# EAGLE design DNVT_box3r (EAGLE 9.6.2)

## Sheet 1 of 3
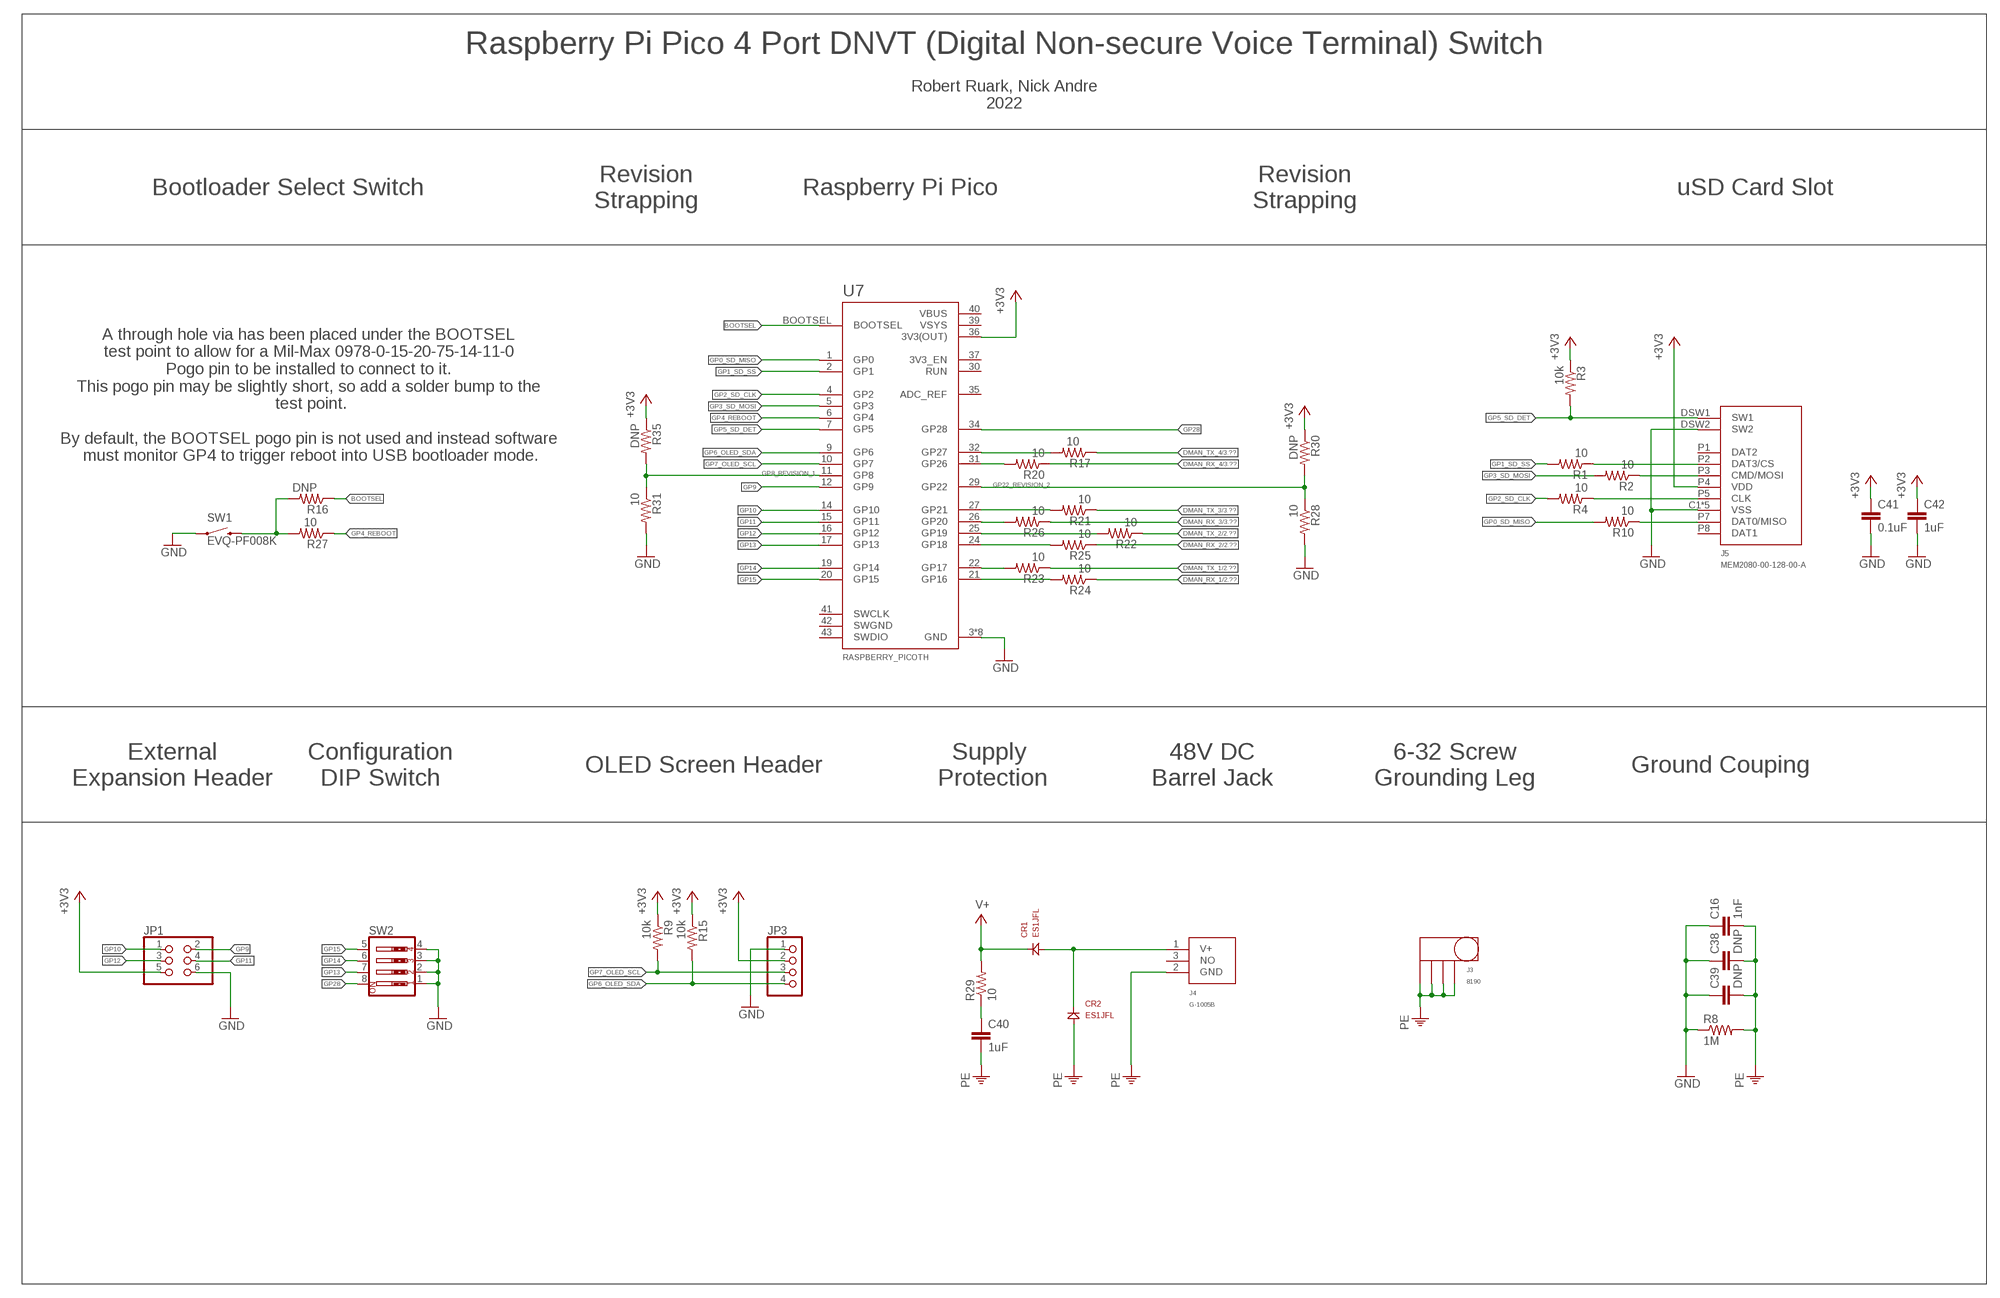
[diagram p0: schematic, sheet 1]

### Parts
C16  1nF  1206_CAPACITOR  [1206]
C38  DNP  1206_CAPACITOR  [1206]
C39  DNP  1206_CAPACITOR  [1206]
C40  1uF  1206_CAPACITOR  [1206]
C41  0.1uF  0603_CAPACITOR  [0603]
C42  1uF  0805_CAPACITOR  [0805]
CR1  ES1JFL  [SOD123(AK)]
CR2  ES1JFL  [SOD123(AK)]
J3  8190  [7781]
J4  G-1005B  [G-1005B]
J5  MEM2080-00-128-00-A  [MEM2080]
JP1  PINHD-2X3/90  [2X03/90]
JP3  PINHD-1X4  [1X04]
R1  10  0603_RESISTOR  [0603]
R2  10  0603_RESISTOR  [0603]
R3  10k  0603_RESISTOR  [0603]
R4  10  0603_RESISTOR  [0603]
R8  1M  1206_RESISTOR  [1206]
R9  10k  0603_RESISTOR  [0603]
R10  10  0603_RESISTOR  [0603]
R15  10k  0603_RESISTOR  [0603]
R16  DNP  0603_RESISTOR  [0603]
R17  10  0603_RESISTOR  [0603]
R20  10  0603_RESISTOR  [0603]
R21  10  0603_RESISTOR  [0603]
R22  10  0603_RESISTOR  [0603]
R23  10  0603_RESISTOR  [0603]
R24  10  0603_RESISTOR  [0603]
R25  10  0603_RESISTOR  [0603]
R26  10  0603_RESISTOR  [0603]
R27  10  0603_RESISTOR  [0603]
R28  10  0603_RESISTOR  [0603]
R29  10  1206_RESISTOR  [1206]
R30  DNP  0603_RESISTOR  [0603]
R31  10  0603_RESISTOR  [0603]
R35  DNP  0603_RESISTOR  [0603]
SW1  EVQ-PF008K  [EVQ-PF008K]
SW2  SW_DIP-4  [EDG-04]
U7  RASPBERRY_PICOTH  [PICO-PKG-TH]

### Nets
+3V3: C41.1 C42.1 J5.P4(VDD) JP1.5 JP3.2 R3.1 R9.1 R15.1 R30.1 R35.1 U7.36(3V3(OUT)) ; also sheet 2,3
BOOTSEL: R16.1 U7.BOOTSEL
DMAN_RX_1: R24.1 ; also sheet 2
DMAN_RX_2: R25.1 ; also sheet 2
DMAN_RX_3: R26.1 ; also sheet 3
DMAN_RX_4: R20.1 ; also sheet 3
DMAN_TX_1: R23.1 ; also sheet 2
DMAN_TX_2: R22.1 ; also sheet 2
DMAN_TX_3: R21.1 ; also sheet 3
DMAN_TX_4: R17.1 ; also sheet 3
GND: C16.1 C38.1 C39.1 C41.2 C42.2 J5.C1(VSS) J5.C2(VSS) J5.C3(VSS) J5.C4(VSS) J5.DSW2(SW2) J5.P6(VSS) JP1.6 JP3.1 R8.1 R28.2 R31.2 SW1.S1 SW2.1 SW2.2 SW2.3 SW2.4 U7.3(GND) U7.8(GND) U7.13(GND) U7.18(GND) U7.23(GND) U7.28(GND) U7.33(GND) U7.38(GND) ; also sheet 2,3
GP0_SD_MISO: R10.2 U7.1(GP0)
GP1_SD_SS: R1.2 U7.2(GP1)
GP2_SD_CLK: R4.2 U7.4(GP2)
GP3_SD_MOSI: R2.2 U7.5(GP3)
GP4_REBOOT: R27.1 U7.6(GP4)
GP5_SD_DET: J5.DSW1(SW1) R3.2 U7.7(GP5)
GP6_OLED_SDA: JP3.4 R15.2 U7.9(GP6)
GP7_OLED_SCL: JP3.3 R9.2 U7.10(GP7)
GP8_REVISION_1: R31.1 R35.2 U7.11(GP8)
GP9: JP1.2 U7.12(GP9)
GP10: JP1.1 U7.14(GP10)
GP11: JP1.4 U7.15(GP11)
GP12: JP1.3 U7.16(GP12)
GP13: SW2.7 U7.17(GP13)
GP14: SW2.6 U7.19(GP14)
GP15: SW2.5 U7.20(GP15)
GP22_REVISION_2: R28.1 R30.2 U7.29(GP22)
GP28: SW2.8 U7.34(GP28)
N$7: R20.2 U7.31(GP26)
N$13: R17.2 U7.32(GP27)
N$17: R24.2 U7.21(GP16)
N$18: R23.2 U7.22(GP17)
N$19: R16.2 R27.2 SW1.S2
N$20: CR1.A CR2.K J4.1(V+)
N$21: R25.2 U7.24(GP18)
N$22: R22.2 U7.25(GP19)
N$23: R21.2 U7.27(GP21)
N$24: R26.2 U7.26(GP20)
N$25: J5.P5(CLK) R4.1
N$27: C40.1 R29.1
N$28: J5.P7(DAT0/MISO) R10.1
N$30: J5.P3(CMD/MOSI) R2.1
N$31: J5.P2(DAT3/CS) R1.1
PE: C16.2 C38.2 C39.2 C40.2 CR2.A J3.P$1 J3.P$2 J3.P$3 J3.P$4 J4.2(GND) R8.2 ; also sheet 2,3
V+: CR1.K R29.2 ; also sheet 2,3
Unconnected: J4.3(NO) J5.P1(DAT2) J5.P8(DAT1) U7.30(RUN) U7.35(ADC_REF) U7.37(3V3_EN) U7.41(SWCLK) U7.43(SWDIO)

### Notes on the sheet
- Raspberry Pi Pico 4 Port DNVT (Digital Non-secure Voice Terminal) Switch
- Robert Ruark, Nick Andre
  2022
- Bootloader Select Switch
- Revision
  Strapping
- Raspberry Pi Pico
- Revision
  Strapping
- uSD Card Slot
- A through hole via has been placed under the BOOTSEL 
  test point to allow for a Mil-Max 0978-0-15-20-75-14-11-0 
  Pogo pin to be installed to connect to it. 
  This pogo pin may be slightly short, so add a solder bump to the 
  test point.
  
  By default, the BOOTSEL pogo pin is not used and instead software 
  must monitor GP4 to trigger reboot into USB bootloader mode.
- External
  Expansion Header
- Configuration
  DIP Switch
- OLED Screen Header
- Supply 
  Protection
- 48V DC
  Barrel Jack
- 6-32 Screw
  Grounding Leg
- Ground Couping

## Sheet 2 of 3
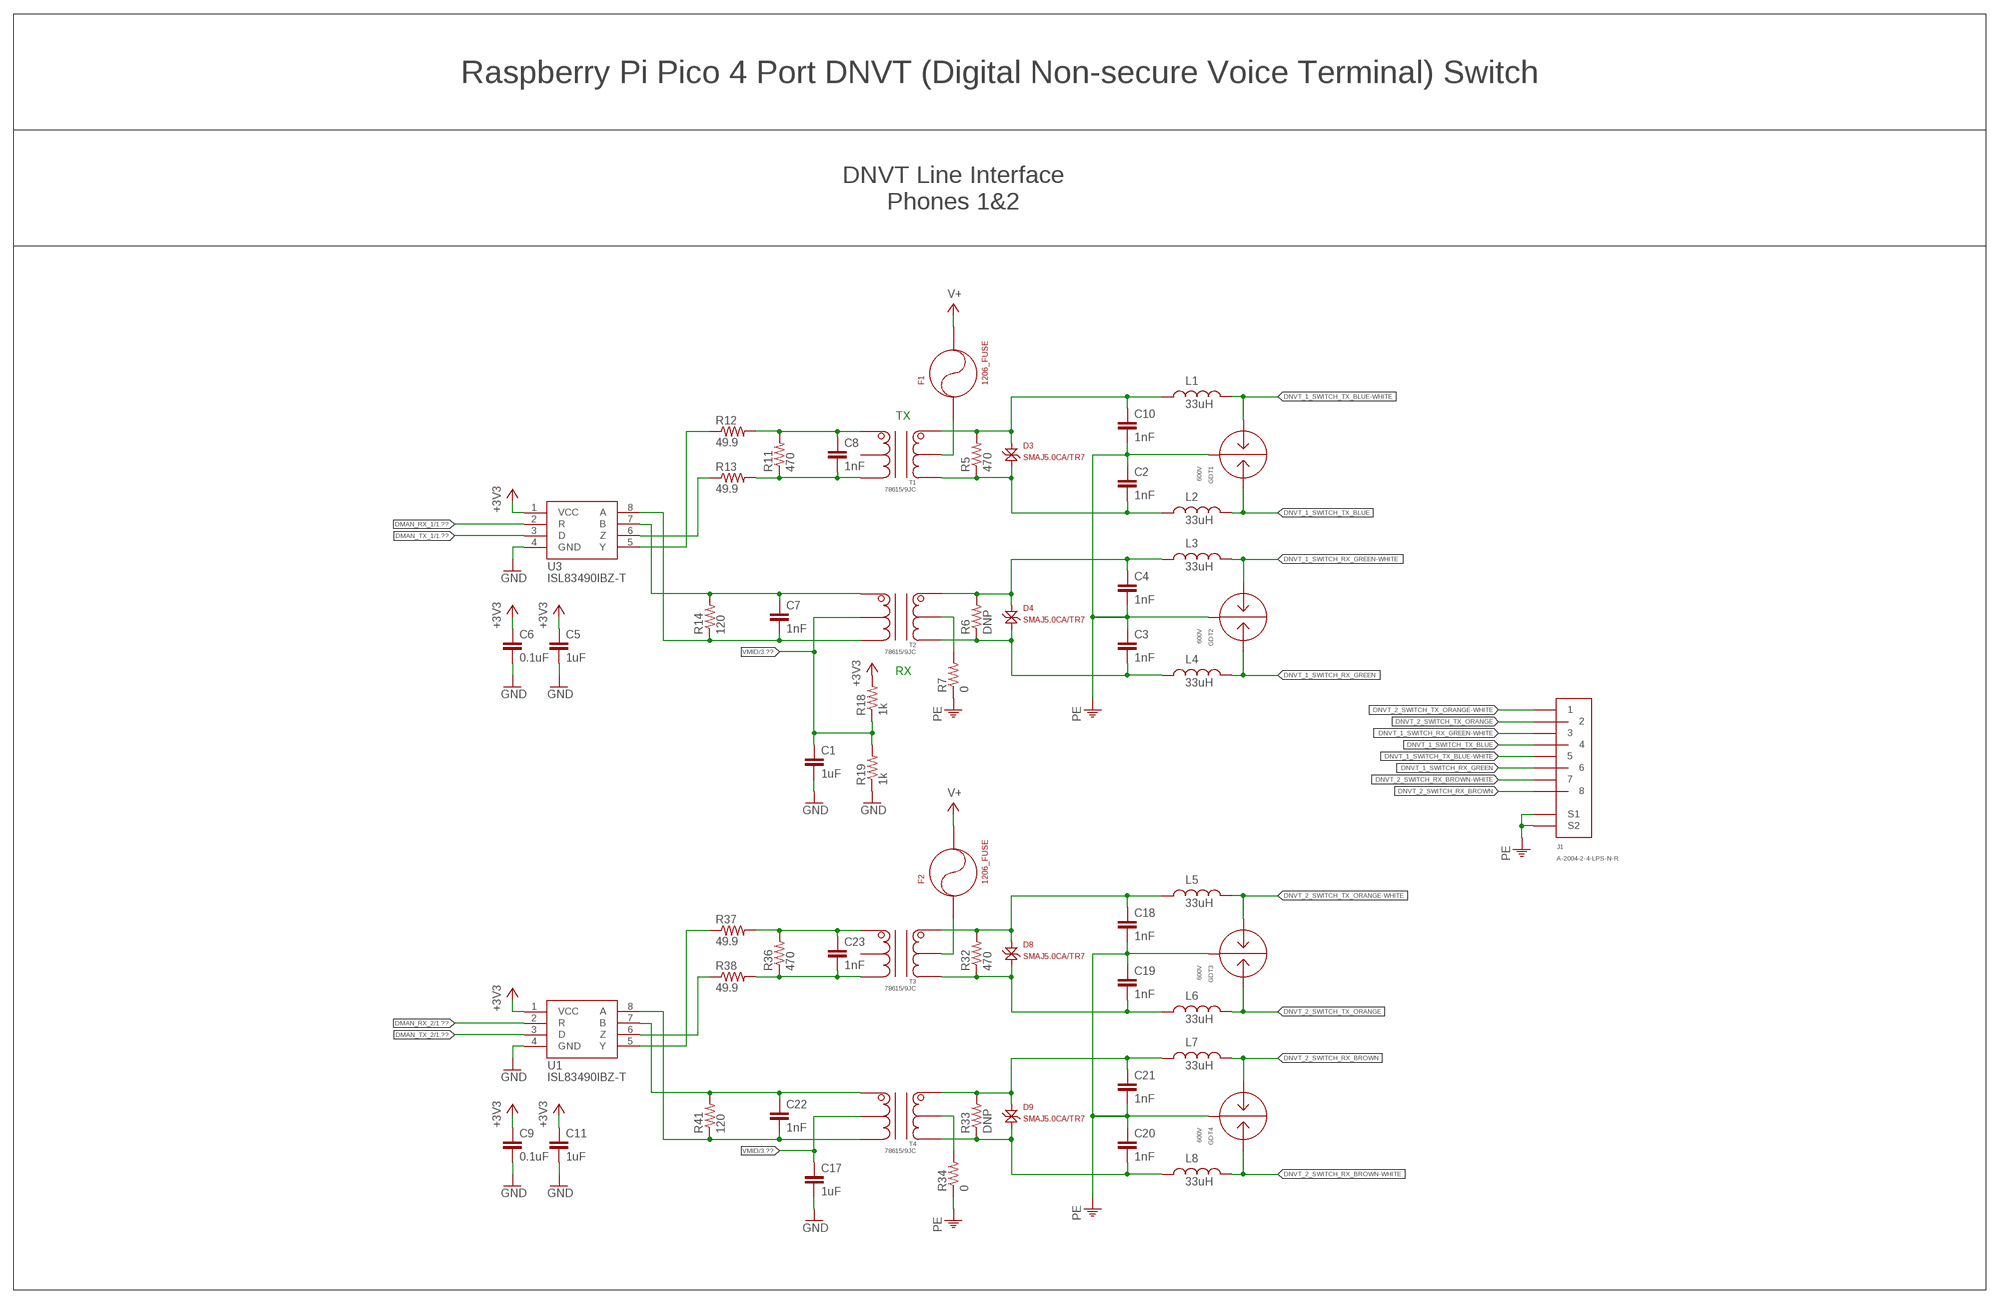
[diagram p1: schematic, sheet 2]

### Parts
C1  1uF  0805_CAPACITOR  [0805]
C2  1nF  0805_CAPACITOR  [0805]
C3  1nF  0805_CAPACITOR  [0805]
C4  1nF  0805_CAPACITOR  [0805]
C5  1uF  0805_CAPACITOR  [0805]
C6  0.1uF  0603_CAPACITOR  [0603]
C7  1nF  0805_CAPACITOR  [0805]
C8  1nF  0805_CAPACITOR  [0805]
C9  0.1uF  0603_CAPACITOR  [0603]
C10  1nF  0805_CAPACITOR  [0805]
C11  1uF  0805_CAPACITOR  [0805]
C17  1uF  0805_CAPACITOR  [0805]
C18  1nF  0805_CAPACITOR  [0805]
C19  1nF  0805_CAPACITOR  [0805]
C20  1nF  0805_CAPACITOR  [0805]
C21  1nF  0805_CAPACITOR  [0805]
C22  1nF  0805_CAPACITOR  [0805]
C23  1nF  0805_CAPACITOR  [0805]
D3  SMAJ5.0CA/TR7  [DO-214AC_NO_POL]
D4  SMAJ5.0CA/TR7  [DO-214AC_NO_POL]
D8  SMAJ5.0CA/TR7  [DO-214AC_NO_POL]
D9  SMAJ5.0CA/TR7  [DO-214AC_NO_POL]
F1  1206_FUSE  [1206]
F2  1206_FUSE  [1206]
GDT1  600V  2036-60-SM-RPLF  [2036_GDT]
GDT2  600V  2036-60-SM-RPLF  [2036_GDT]
GDT3  600V  2036-60-SM-RPLF  [2036_GDT]
GDT4  600V  2036-60-SM-RPLF  [2036_GDT]
J1  A-2004-2-4-LPS-N-R  [A-2004-2-4-LPS-N-R]
L1  33uH  SDR0403-330KL  [SDR0403]
L2  33uH  SDR0403-330KL  [SDR0403]
L3  33uH  SDR0403-330KL  [SDR0403]
L4  33uH  SDR0403-330KL  [SDR0403]
L5  33uH  SDR0403-330KL  [SDR0403]
L6  33uH  SDR0403-330KL  [SDR0403]
L7  33uH  SDR0403-330KL  [SDR0403]
L8  33uH  SDR0403-330KL  [SDR0403]
R5  470  R-US_R0805  [R0805]
R6  DNP  R-US_R0805  [R0805]
R7  0  R-US_R0805  [R0805]
R11  470  R-US_R0805  [R0805]
R12  49.9  R-US_R0805  [R0805]
R13  49.9  R-US_R0805  [R0805]
R14  120  1206_RESISTOR  [1206]
R18  1k  0603_RESISTOR  [0603]
R19  1k  0603_RESISTOR  [0603]
R32  470  R-US_R0805  [R0805]
R33  DNP  R-US_R0805  [R0805]
R34  0  R-US_R0805  [R0805]
R36  470  R-US_R0805  [R0805]
R37  49.9  R-US_R0805  [R0805]
R38  49.9  R-US_R0805  [R0805]
R41  120  1206_RESISTOR  [1206]
T1  78615/9JC  [786]
T2  78615/9JC  [786]
T3  78615/9JC  [786]
T4  78615/9JC  [786]
U1  ISL83490IBZ-T  [SOIC8]
U3  ISL83490IBZ-T  [SOIC8]

### Nets
+3V3: C5.1 C6.1 C9.1 C11.1 R18.2 U1.1(VCC) U3.1(VCC) ; also sheet 1,3
DMAN_RX_1: U3.2(R) ; also sheet 1
DMAN_RX_2: U1.2(R) ; also sheet 1
DMAN_TX_1: U3.3(D) ; also sheet 1
DMAN_TX_2: U1.3(D) ; also sheet 1
DNVT_1_SWITCH_RX_GREEN: GDT2.L2 J1.6 L4.2
DNVT_1_SWITCH_RX_GREEN-WHITE: GDT2.L1 J1.3 L3.2
DNVT_1_SWITCH_TX_BLUE: GDT1.L2 J1.4 L2.2
DNVT_1_SWITCH_TX_BLUE-WHITE: GDT1.L1 J1.5 L1.2
DNVT_2_SWITCH_RX_BROWN: GDT4.L1 J1.8 L7.2
DNVT_2_SWITCH_RX_BROWN-WHITE: GDT4.L2 J1.7 L8.2
DNVT_2_SWITCH_TX_ORANGE: GDT3.L2 J1.2 L6.2
DNVT_2_SWITCH_TX_ORANGE-WHITE: GDT3.L1 J1.1 L5.2
GND: C1.2 C5.2 C6.2 C9.2 C11.2 C17.2 R19.1 U1.4(GND) U3.4(GND) ; also sheet 1,3
N$1: C10.1 D3.C(K) L1.1 R5.2 T1.1
N$2: C2.2 D3.A L2.1 R5.1 T1.3
N$3: C4.1 D4.C(K) L3.1 R6.2 T2.1
N$4: C3.2 D4.A L4.1 R6.1 T2.3
N$5: R7.2 T2.2
N$6: F1.1 T1.2
N$8: C22.1 R41.2 T4.6 U1.7(B)
N$9: C7.1 R14.2 T2.6 U3.7(B)
N$10: C7.2 R14.1 T2.4 U3.8(A)
N$11: C8.2 R11.1 R13.2 T1.4
N$12: C8.1 R11.2 R12.2 T1.6
N$14: R12.1 U3.5(Y)
N$16: R13.1 U3.6(Z)
N$44: C22.2 R41.1 T4.4 U1.8(A)
N$63: C18.1 D8.C(K) L5.1 R32.2 T3.1
N$64: C19.2 D8.A L6.1 R32.1 T3.3
N$65: C21.1 D9.C(K) L7.1 R33.2 T4.1
N$66: C20.2 D9.A L8.1 R33.1 T4.3
N$67: R34.2 T4.2
N$68: F2.1 T3.2
N$71: C23.1 R36.2 R37.2 T3.6
N$72: R37.1 U1.5(Y)
N$73: R38.1 U1.6(Z)
N$79: C23.2 R36.1 R38.2 T3.4
PE: C2.1 C3.1 C4.2 C10.2 C18.2 C19.1 C20.1 C21.2 GDT1.C GDT2.C GDT3.C GDT4.C J1.S1 J1.S2 R7.1 R34.1 ; also sheet 1,3
V+: F1.2 F2.2 ; also sheet 1,3
VMID: C1.1 C17.1 R18.1 R19.2 T2.5 T4.5 ; also sheet 3
Unconnected: T1.5 T3.5

### Notes on the sheet
- Raspberry Pi Pico 4 Port DNVT (Digital Non-secure Voice Terminal) Switch
- DNVT Line Interface
  Phones 1&2
- TX
- RX

## Sheet 3 of 3
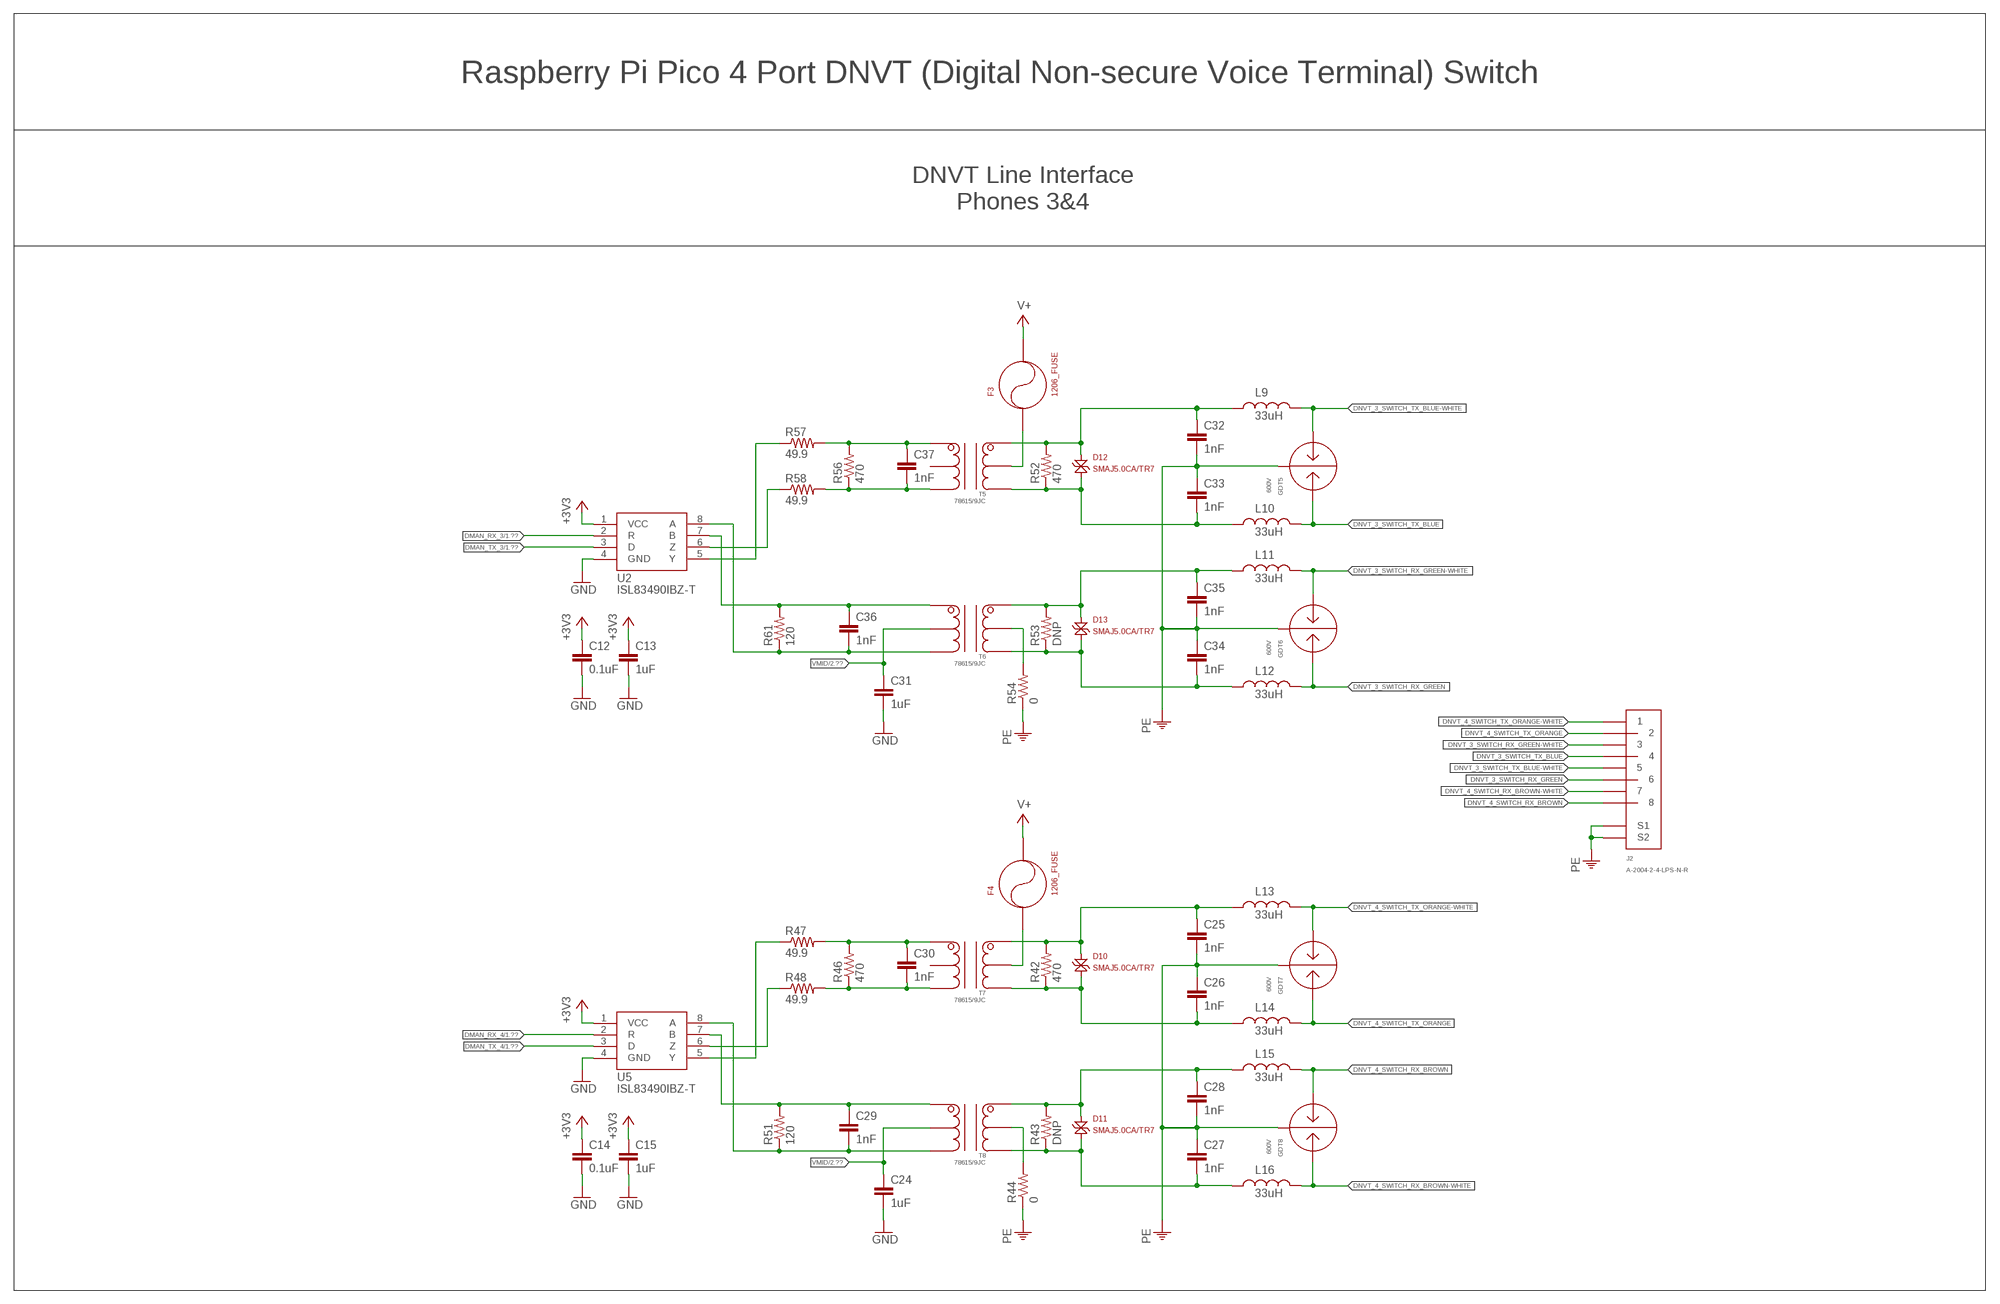
[diagram p2: schematic, sheet 3]

### Parts
C12  0.1uF  0603_CAPACITOR  [0603]
C13  1uF  0805_CAPACITOR  [0805]
C14  0.1uF  0603_CAPACITOR  [0603]
C15  1uF  0805_CAPACITOR  [0805]
C24  1uF  0805_CAPACITOR  [0805]
C25  1nF  0805_CAPACITOR  [0805]
C26  1nF  0805_CAPACITOR  [0805]
C27  1nF  0805_CAPACITOR  [0805]
C28  1nF  0805_CAPACITOR  [0805]
C29  1nF  0805_CAPACITOR  [0805]
C30  1nF  0805_CAPACITOR  [0805]
C31  1uF  0805_CAPACITOR  [0805]
C32  1nF  0805_CAPACITOR  [0805]
C33  1nF  0805_CAPACITOR  [0805]
C34  1nF  0805_CAPACITOR  [0805]
C35  1nF  0805_CAPACITOR  [0805]
C36  1nF  0805_CAPACITOR  [0805]
C37  1nF  0805_CAPACITOR  [0805]
D10  SMAJ5.0CA/TR7  [DO-214AC_NO_POL]
D11  SMAJ5.0CA/TR7  [DO-214AC_NO_POL]
D12  SMAJ5.0CA/TR7  [DO-214AC_NO_POL]
D13  SMAJ5.0CA/TR7  [DO-214AC_NO_POL]
F3  1206_FUSE  [1206]
F4  1206_FUSE  [1206]
GDT5  600V  2036-60-SM-RPLF  [2036_GDT]
GDT6  600V  2036-60-SM-RPLF  [2036_GDT]
GDT7  600V  2036-60-SM-RPLF  [2036_GDT]
GDT8  600V  2036-60-SM-RPLF  [2036_GDT]
J2  A-2004-2-4-LPS-N-R  [A-2004-2-4-LPS-N-R]
L9  33uH  SDR0403-330KL  [SDR0403]
L10  33uH  SDR0403-330KL  [SDR0403]
L11  33uH  SDR0403-330KL  [SDR0403]
L12  33uH  SDR0403-330KL  [SDR0403]
L13  33uH  SDR0403-330KL  [SDR0403]
L14  33uH  SDR0403-330KL  [SDR0403]
L15  33uH  SDR0403-330KL  [SDR0403]
L16  33uH  SDR0403-330KL  [SDR0403]
R42  470  R-US_R0805  [R0805]
R43  DNP  R-US_R0805  [R0805]
R44  0  R-US_R0805  [R0805]
R46  470  R-US_R0805  [R0805]
R47  49.9  R-US_R0805  [R0805]
R48  49.9  R-US_R0805  [R0805]
R51  120  1206_RESISTOR  [1206]
R52  470  R-US_R0805  [R0805]
R53  DNP  R-US_R0805  [R0805]
R54  0  R-US_R0805  [R0805]
R56  470  R-US_R0805  [R0805]
R57  49.9  R-US_R0805  [R0805]
R58  49.9  R-US_R0805  [R0805]
R61  120  1206_RESISTOR  [1206]
T5  78615/9JC  [786]
T6  78615/9JC  [786]
T7  78615/9JC  [786]
T8  78615/9JC  [786]
U2  ISL83490IBZ-T  [SOIC8]
U5  ISL83490IBZ-T  [SOIC8]

### Nets
+3V3: C12.1 C13.1 C14.1 C15.1 U2.1(VCC) U5.1(VCC) ; also sheet 1,2
DMAN_RX_3: U2.2(R) ; also sheet 1
DMAN_RX_4: U5.2(R) ; also sheet 1
DMAN_TX_3: U2.3(D) ; also sheet 1
DMAN_TX_4: U5.3(D) ; also sheet 1
DNVT_3_SWITCH_RX_GREEN: GDT6.L2 J2.6 L12.2
DNVT_3_SWITCH_RX_GREEN-WHITE: GDT6.L1 J2.3 L11.2
DNVT_3_SWITCH_TX_BLUE: GDT5.L2 J2.4 L10.2
DNVT_3_SWITCH_TX_BLUE-WHITE: GDT5.L1 J2.5 L9.2
DNVT_4_SWITCH_RX_BROWN: GDT8.L1 J2.8 L15.2
DNVT_4_SWITCH_RX_BROWN-WHITE: GDT8.L2 J2.7 L16.2
DNVT_4_SWITCH_TX_ORANGE: GDT7.L2 J2.2 L14.2
DNVT_4_SWITCH_TX_ORANGE-WHITE: GDT7.L1 J2.1 L13.2
GND: C12.2 C13.2 C14.2 C15.2 C24.2 C31.2 U2.4(GND) U5.4(GND) ; also sheet 1,2
N$45: C36.1 R61.2 T6.6 U2.7(B)
N$52: C36.2 R61.1 T6.4 U2.8(A)
N$81: C25.1 D10.C(K) L13.1 R42.2 T7.1
N$82: C26.2 D10.A L14.1 R42.1 T7.3
N$83: C28.1 D11.C(K) L15.1 R43.2 T8.1
N$84: C27.2 D11.A L16.1 R43.1 T8.3
N$85: R44.2 T8.2
N$86: F4.1 T7.2
N$88: C29.1 R51.2 T8.6 U5.7(B)
N$89: C30.1 R46.2 R47.2 T7.6
N$90: R47.1 U5.5(Y)
N$91: R48.1 U5.6(Z)
N$97: C30.2 R46.1 R48.2 T7.4
N$98: C29.2 R51.1 T8.4 U5.8(A)
N$99: C32.1 D12.C(K) L9.1 R52.2 T5.1
N$100: C33.2 D12.A L10.1 R52.1 T5.3
N$101: C35.1 D13.C(K) L11.1 R53.2 T6.1
N$102: C34.2 D13.A L12.1 R53.1 T6.3
N$103: R54.2 T6.2
N$104: F3.1 T5.2
N$107: C37.1 R56.2 R57.2 T5.6
N$108: R57.1 U2.5(Y)
N$109: R58.1 U2.6(Z)
N$115: C37.2 R56.1 R58.2 T5.4
PE: C25.2 C26.1 C27.1 C28.2 C32.2 C33.1 C34.1 C35.2 GDT5.C GDT6.C GDT7.C GDT8.C J2.S1 J2.S2 R44.1 R54.1 ; also sheet 1,2
V+: F3.2 F4.2 ; also sheet 1,2
VMID: C24.1 C31.1 T6.5 T8.5 ; also sheet 2
Unconnected: T5.5 T7.5

### Notes on the sheet
- Raspberry Pi Pico 4 Port DNVT (Digital Non-secure Voice Terminal) Switch
- DNVT Line Interface
  Phones 3&4

## Power pins joined to a net without a drawn wire
SWGND: U7.42(SWGND)
VBUS: U7.40(VBUS)
VSYS: U7.39(VSYS)

## Library data of the parts
C1-C5 C7 C8 C10 C11 C13 C15 C17-C37 C42 = ruark2:0805_CAPACITOR: NO DEFINED PN
C6 C9 C12 C14 C41 = ruark2:0603_CAPACITOR: 0603 Capacitor -- WARNING: NO DEFINED VALUE OR PART NUMBER; VALUE: sel
C16 C38-C40 = ruark2:1206_CAPACITOR: NO DEFINED PN; VALUE: sel
CR1 CR2 = ruark2:ES1JFL: Diode Standard 600 V 1A Surface Mount SOD-123F; PARTNO: ES1JFLCT-ND
D3 D4 D8-D13 = ruark2:SMAJ5.0CA/TR7: 9.2V Clamp 43.5A Ipp Tvs Diode Surface Mount DO-214AC (SMA)
F1-F4 = ruark2:1206_FUSE
GDT1-GDT8 = ruark2:2036-60-SM-RPLF: Gas Discharge Tube 600 V 10000A (10kA) ±20% 3 Pole Surface Mount LCSC Knockoff SE90-600X; PARTNO: 2036-60-SM-RPLFCT-ND
J1 J2 = ruark2:A-2004-2-4-LPS-N-R: Jack Modular Connector 8p8c (RJ45, Ethernet) 90° Angle (Right) Shielded Asian alternate: RCH RC00994; PARTNO: AE10387-ND
J3 = ruark2:8190: 4 Pin Screw Terminal, Power Tap 6-32 Through Hole, Right Angle; PARTNO: 36-8190-ND
J4 = ruark2:G-1005B: Power Barrel Connector Jack 2.50mm ID (0.098"), 5.50mm OD (0.217") Through Hole, Right Angle; PARTNO: 1939-G-1005B-ND
J5 = ruark2:MEM2080-00-128-00-A: 9 (8 + 1) Position Card Connector Secure Digital - microSD™ Surface Mount, Right Angle Gold; PARTNO: 2073-MEM2080-00-128-00-ACT-ND
JP1 = pinhead:PINHD-2X3: PIN HEADER
JP3 = pinhead:PINHD-1X4: PIN HEADER
L1-L16 = ruark2:SDR0403-330KL: 33 µH Unshielded Drum Core, Wirewound Inductor 640 mA 540mOhm Max Nonstandard LCSC knockoff: SM4532-330MT; PARTNO: SDR0403-330KLCT-ND
R1-R4 R9 R10 R15-R28 R30 R31 R35 = ruark2:0603_RESISTOR: 0603 Resistor -- WARNING: NO DEFINED PART NUMBER OR VALUE; VALUE: sel
R5-R7 R11-R13 R32-R34 R36-R38 R42-R44 R46-R48 R52-R54 R56-R58 = rcl:R-US_: RESISTOR, American symbol; SPICEPREFIX: R
R8 R14 R29 R41 R51 R61 = ruark2:1206_RESISTOR: NO DEFINED PN; VALUE: sel
SW1 = ruark2:EVQ-PF008K: Tactile Switch SPST-NO Side Actuated Through Hole, Right Angle; PARTNO: P10880S-ND
SW2 = special:SW_DIP-4: DIP SWITCH
T1-T8 = ruark2:78615/9JC: 10mH General Purpose Pulse Transformer 1CT:1CT Surface Mount 56Vus; PARTNO: 811-2423-ND
U1-U3 U5 = ruark2:ISL83490IBZ-T: 1/1 Transceiver Full RS422, RS485 8-SOIC 3.3V; PARTNO: ISL83490IBZ-TCT-ND
U7 = ruark2:RASPBERRY_PICO: Raspberry Pi Pico

## Net classes
1 HV: clearance 0.406 mm

## Board
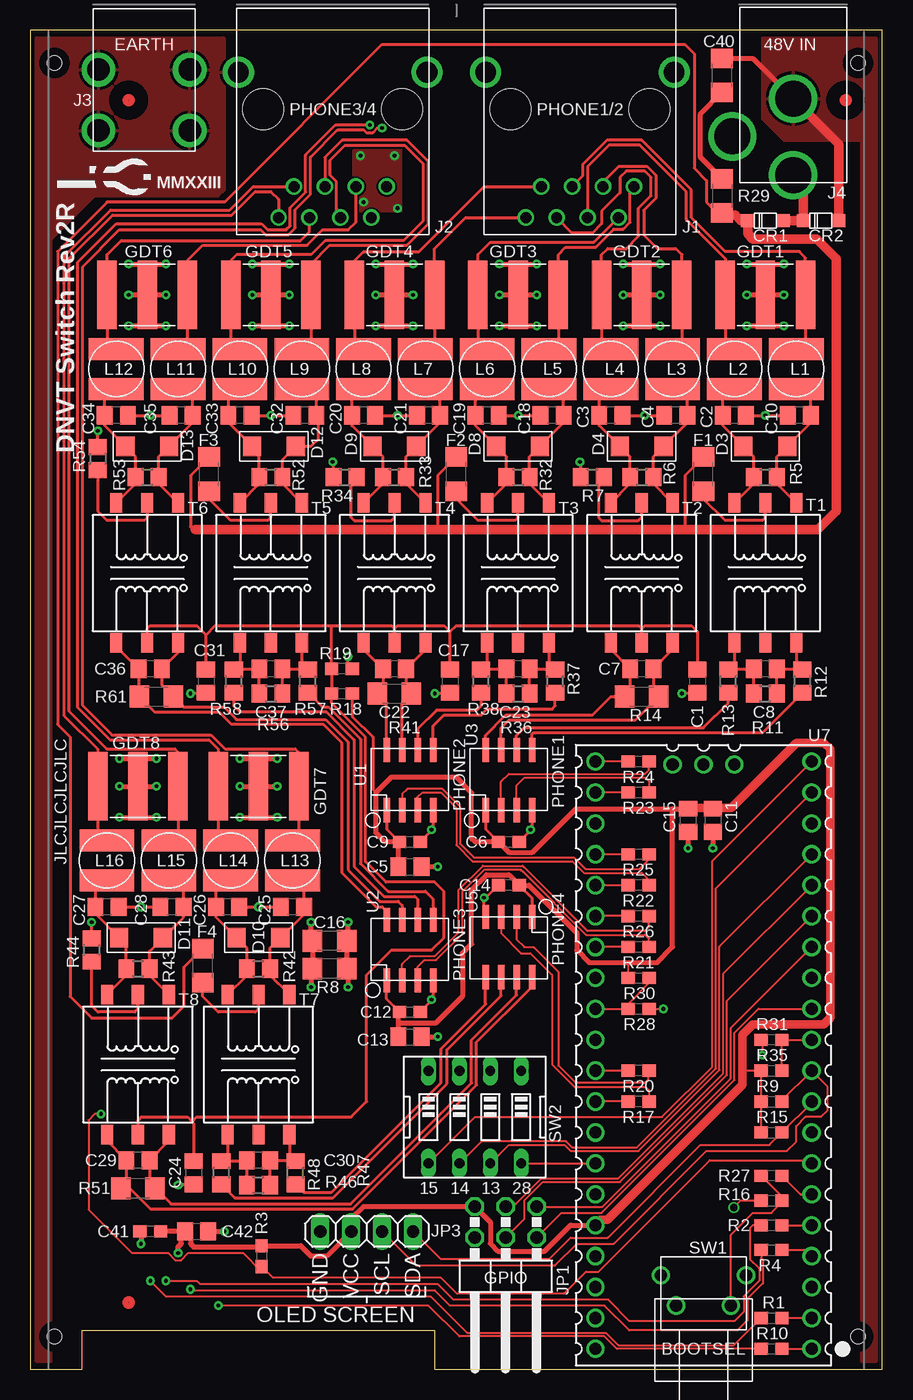
[diagram p3: board, top side]
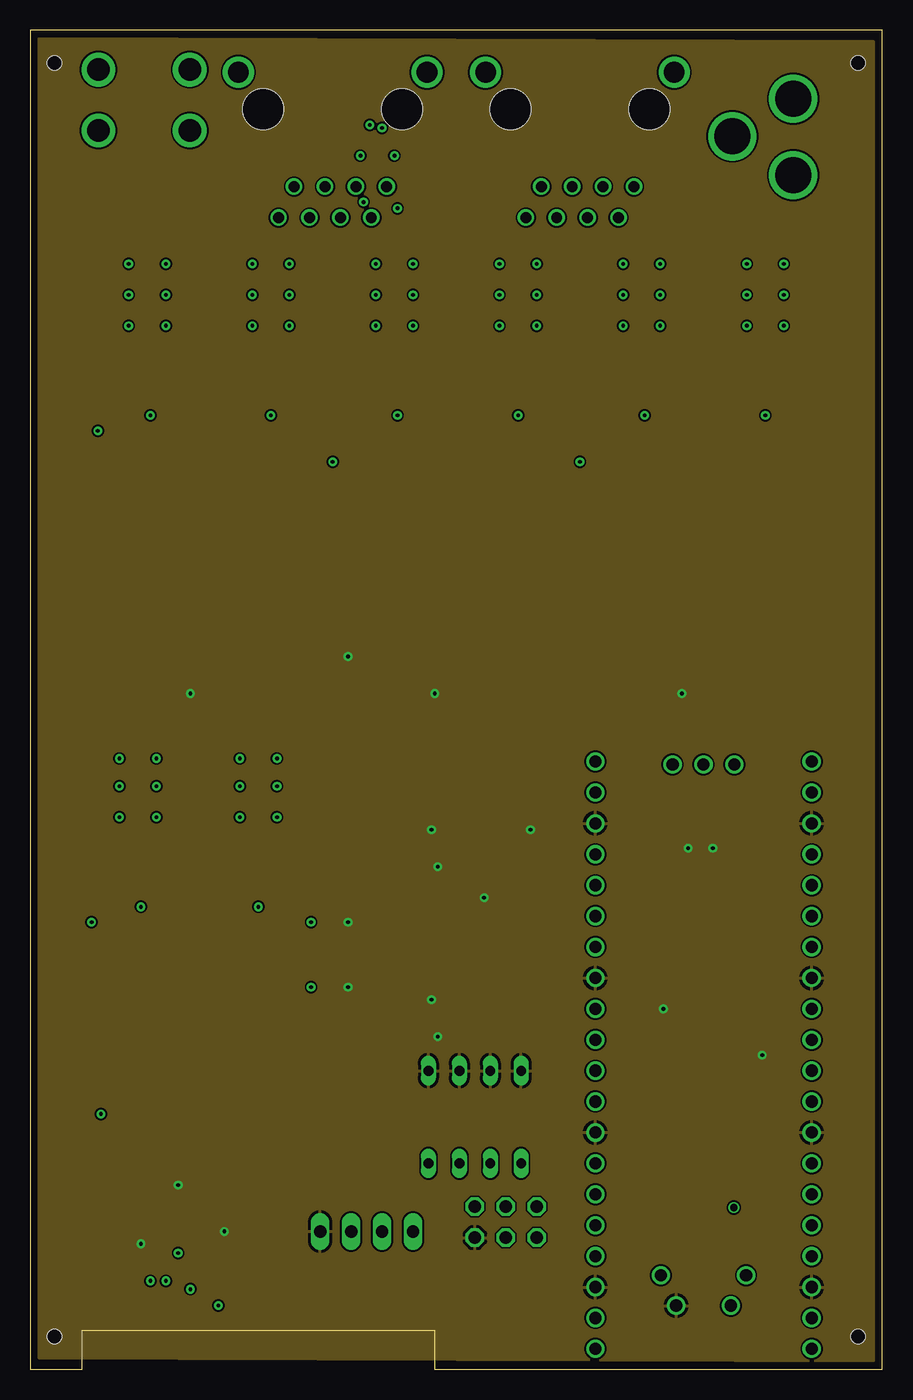
[diagram p4: board, inner layer Route2]
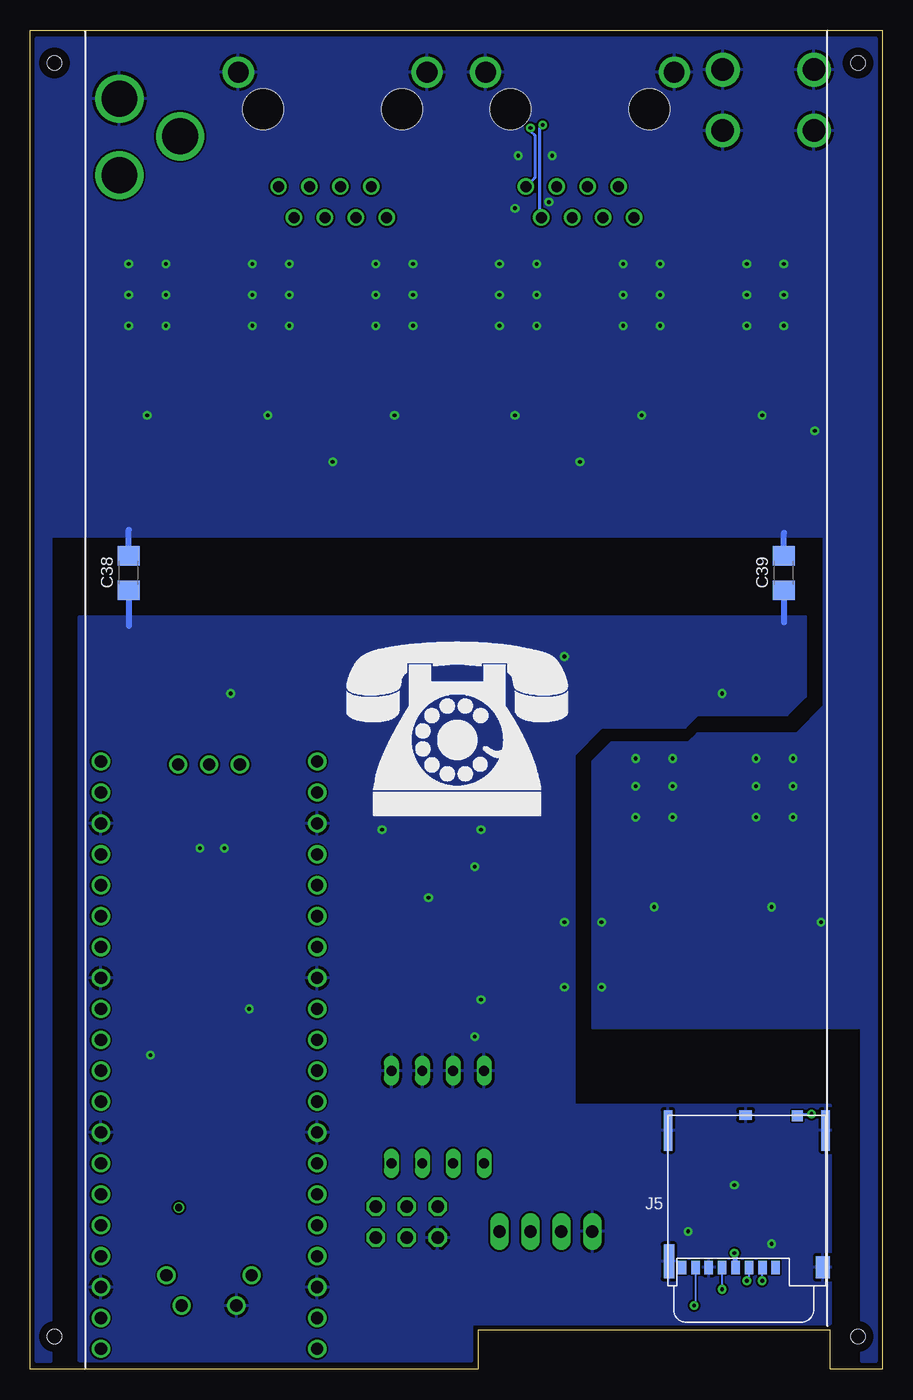
[diagram p5: board, bottom side, seen from below]

Size 70 x 110 mm. Coordinates in mm from the lower left corner, seen from the top.
Outline: 0,0 4.27,0 4.27,3.18 33.22,3.18 33.22,0 70,0 70,110 0,110 0,0
Copper layers (1*16): Top 0.035mm / dielectric 1.5mm / Bottom 0.035mm
Design rules "default *": minimum track width 6mil, minimum drill 12mil, track to track 6mil, track to pad 6mil, pad to pad 6mil, via to via 6mil, smd to smd 6mil, copper to edge 0mil, drill to drill 6mil, minimum pad ring 0.13mm, minimum via ring 8mil, stop-mask expansion 4mil, vias tented up to drill 12mil, thermal gap 10mil
Holes 1.15 mm at 1.98,107.32 68.02,107.32 1.98,2.68 68.02,2.68
tRestrict: area 7,103.2 to 9.2,105.4; area 65.9,103.2 to 68.1,105.4; area 7,4.4 to 9.2,6.6; area 1,106.3 to 3,108.3; area 67,106.3 to 69,108.3; area 67,1.7 to 69,3.7; area 1,1.7 to 3,3.7
bRestrict: area 1,106.3 to 3,108.3; area 67,106.3 to 69,108.3; area 67,1.7 to 69,3.7; area 1,1.7 to 3,3.7

### Footprints (pad centres in the part's own frame; a part is rotated, then mirrored left to right if it is on the bottom)
0805 = smd 1.3 x 1.5: 1 -0.95,0; 2 0.95,0
0603 = smd 1.1 x 1: 1 -0.85,0; 2 0.85,0
1206 = smd 1.6 x 1.8: 1 -1.4,0; 2 1.4,0
SOD123(AK) = smd 1.1 x 1.1: A 1.45,0; K -1.45,0
DO-214AC_NO_POL = smd 1.5 x 1.6: A -1.8,0; C 1.8,0
2036_GDT = smd 1.6 x 5.6: C 0,0; L1 -3.3,0; L2 3.3,0
A-2004-2-4-LPS-N-R = drill 0.9: 1 4.445,-6.35; 2 3.175,-8.89; 3 1.905,-6.35; 4 0.635,-8.89; 5 -0.635,-6.35; 6 -1.905,-8.89; 7 -3.175,-6.35; 8 -4.445,-8.89 | drill 1.7: S1 -7.75,3.05; S2 7.75,3.05 | hole 3.35: -5.715,0; 5.715,0
7781 = drill 1.85: P$1 -3.75,2.5; P$2 3.75,2.5; P$3 -3.75,-2.5; P$4 3.75,-2.5
G-1005B = drill 2.95: 1 0,13.8; 2 0,7.5; 3 5,10.6
MEM2080 = smd 1.14 x 1.83: C1 -6.26,6 | smd 0.86 x 2.8: C2 6.4,5.515 | smd 0.7 x 3.33: C3 -6.48,-5.25; C4 6.48,-5.25 | smd 0.9 x 0.93: DSW1 -4.17,-6.45 | smd 1.05 x 0.78: DSW2 0.095,-6.525 | smd 0.7 x 1.1: P1 -2.38,6.015; P2 -1.28,6.015; P3 -0.18,6.015; P4 0.92,6.015; P5 2.02,6.015; P6 3.12,6.015; P7 4.22,6.015; P8 5.32,6.015
2X03/90 = drill 1.016 octagon: 1 -2.54,-6.35; 2 -2.54,-3.81; 3 0,-6.35; 4 0,-3.81; 5 2.54,-6.35; 6 2.54,-3.81
1X04 = drill 1.016 long: 1 -3.81,0; 2 -1.27,0; 3 1.27,0; 4 3.81,0
SDR0403 = smd 4.5 x 1.8: 1 0,1.65; 2 0,-1.65
R0805 = smd 1.3 x 1.5: 1 -0.95,0; 2 0.95,0
EVQ-PF008K = drill 1: NC1 -3.5,2.5; NC2 3.5,2.5; S1 -2.25,0; S2 2.25,0
EDG-04 = drill 0.813 long: 1 -3.81,-3.81; 2 -1.27,-3.81; 3 1.27,-3.81; 4 3.81,-3.81; 5 3.81,3.81; 6 1.27,3.81; 7 -1.27,3.81; 8 -3.81,3.81
786 = smd 1.6 x 1: 1 -5.75,2.54; 2 -5.75,0; 3 -5.75,-2.54; 4 5.75,-2.54; 5 5.75,0; 6 5.75,2.54
SOIC8 = smd 1.981 x 0.533: 1 -2.477,1.905; 2 -2.477,0.635; 3 -2.477,-0.635; 4 -2.477,-1.905; 5 2.477,-1.905; 6 2.477,-0.635; 7 2.477,0.635; 8 2.477,1.905
PICO-PKG-TH = drill 1: 1 -8.89,24.13; 2 -8.89,21.59; 3 -8.89,19.05; 4 -8.89,16.51; 5 -8.89,13.97; 6 -8.89,11.43; 7 -8.89,8.89; 8 -8.89,6.35; 9 -8.89,3.81; 10 -8.89,1.27; 11 -8.89,-1.27; 12 -8.89,-3.81; 13 -8.89,-6.35; 14 -8.89,-8.89; 15 -8.89,-11.43; 16 -8.89,-13.97; 17 -8.89,-16.51; 18 -8.89,-19.05; 19 -8.89,-21.59; 20 -8.89,-24.13; 21 8.89,-24.13; 22 8.89,-21.59; 23 8.89,-19.05; 24 8.89,-16.51; 25 8.89,-13.97; 26 8.89,-11.43; 27 8.89,-8.89; 28 8.89,-6.35; 29 8.89,-3.81; 30 8.89,-1.27; 31 8.89,1.27; 32 8.89,3.81; 33 8.89,6.35; 34 8.89,8.89; 35 8.89,11.43; 36 8.89,13.97; 37 8.89,16.51; 38 8.89,19.05; 39 8.89,21.59; 40 8.89,24.13; 41 -2.54,-23.9; 42 0,-23.9; 43 2.54,-23.9 | drill 0.584: BOOTSEL -2.489,12.522

### Placement (x,y rotation side)
C1  54.81,56.52 270 top
C2  57.86,78.37 180 top
C3  47.7,78.37 180 top
C4  53.03,78.37 180 top
C5  31.19,41.28 0 top
C6  39.32,43.32 0 top
C7  50.24,57.54 180 top
C8  60.4,57.54 180 top
C9  31.19,43.32 0 top
C10  63.19,78.37 180 top
C11  56.08,45.09 270 top
C12  31.19,29.35 0 top
C13  31.19,27.31 0 top
C14  39.32,39.76 180 top
C15  54.05,45.09 270 top
C16  24.59,35.19 180 top
C17  34.49,56.52 270 top
C18  42.87,78.37 180 top
C19  37.54,78.37 180 top
C20  27.38,78.37 180 top
C21  32.71,78.37 180 top
C22  29.92,57.54 180 top
C23  40.08,57.54 180 top
C24  13.41,16.14 270 top
C25  21.54,37.98 180 top
C26  16.2,37.98 180 top
C27  6.3,37.98 180 top
C28  11.63,37.98 180 top
C29  8.84,17.15 180 top
C30  18.74,17.15 180 top
C31  14.43,56.52 270 top
C32  22.55,78.37 180 top
C33  17.22,78.37 180 top
C34  7.06,78.37 180 top
C35  12.39,78.37 180 top
C36  9.85,57.54 180 top
C37  19.76,57.54 180 top
C38  61.92,65.41 90 bottom
C39  8.08,65.41 90 bottom
C40  56.84,106.31 90 top
C41  9.85,11.31 180 top
C42  13.66,11.31 0 top
CR1  60.4,94.37 0 top
CR2  64.97,94.37 0 top
D3  60.4,75.83 0 top
D4  50.24,75.83 0 top
D8  40.08,75.83 0 top
D9  29.92,75.83 0 top
D10  18.74,35.44 0 top
D11  9.09,35.44 0 top
D12  20.01,75.83 0 top
D13  9.6,75.83 0 top
F1  55.32,73.54 90 top
F2  35,73.54 90 top
F3  14.68,73.54 90 top
F4  14.17,33.16 90 top
GDT1  60.4,88.27 180 top
GDT2  50.24,88.27 180 top
GDT3  40.08,88.27 180 top
GDT4  29.92,88.27 180 top
GDT5  19.76,88.27 180 top
GDT6  9.6,88.27 180 top
GDT7  18.74,47.89 180 top
GDT8  8.84,47.89 180 top
J1  45.16,103.51 0 top
J2  24.84,103.51 0 top
J3  9.35,104.28 0 top
J4  62.69,111.9 180 top
J5  11.12,14.36 180 bottom
JP1  39.06,6.99 180 top
JP3  27.63,11.31 0 top
L1  62.94,82.18 180 top
L2  57.86,82.18 180 top
L3  52.78,82.18 180 top
L4  47.7,82.18 180 top
L5  42.62,82.18 180 top
L6  37.54,82.18 180 top
L7  32.46,82.18 180 top
L8  27.38,82.18 180 top
L9  22.3,82.18 180 top
L10  17.22,82.18 180 top
L11  12.14,82.18 180 top
L12  7.06,82.18 180 top
L13  21.54,41.79 180 top
L14  16.46,41.79 180 top
L15  11.38,41.79 180 top
L16  6.3,41.79 180 top
R1  60.91,4.2 0 top
R2  60.91,11.82 0 top
R3  19,9.28 270 top
R4  60.91,9.79 0 top
R5  60.4,73.29 0 top
R6  50.24,73.29 0 top
R7  46.18,73.29 0 top
R8  24.59,32.9 180 top
R9  60.91,21.98 0 top
R10  60.91,1.66 0 top
R11  60.4,55.51 0 top
R12  63.45,56.52 90 top
R13  57.35,56.52 90 top
R14  50.24,55.25 0 top
R15  60.91,19.44 0 top
R16  60.91,13.85 0 top
R17  49.99,21.98 180 top
R18  25.6,55.51 0 top
R19  25.6,57.54 180 top
R20  49.99,24.52 180 top
R21  49.99,34.68 180 top
R22  49.99,39.76 180 top
R23  49.99,47.38 180 top
R24  49.99,49.92 180 top
R25  49.99,42.3 180 top
R26  49.99,37.22 180 top
R27  60.91,15.88 180 top
R28  49.99,29.6 0 top
R29  56.84,96.4 270 top
R30  49.99,32.14 0 top
R31  60.91,27.06 180 top
R32  40.08,73.29 0 top
R33  29.92,73.29 0 top
R34  25.86,73.29 0 top
R35  60.91,24.52 0 top
R36  40.08,55.51 0 top
R37  43.13,56.52 90 top
R38  37.03,56.52 90 top
R41  29.92,55.51 0 top
R42  18.74,32.9 0 top
R43  8.84,32.9 0 top
R44  5.03,34.43 270 top
R46  18.74,15.12 0 top
R47  21.79,16.14 90 top
R48  15.7,16.14 90 top
R51  8.84,14.87 0 top
R52  19.76,73.29 0 top
R53  9.6,73.29 0 top
R54  5.54,74.81 270 top
R56  19.76,55.51 0 top
R57  22.81,56.52 90 top
R58  16.71,56.52 90 top
R61  10.36,55.25 0 top
SW1  55.32,5.22 0 top
SW2  36.52,20.71 180 top
T1  60.4,65.41 270 top
T2  50.24,65.41 270 top
T3  40.08,65.41 270 top
T4  29.92,65.41 270 top
T5  19.76,65.41 270 top
T6  9.6,65.41 270 top
T7  18.74,25.03 270 top
T8  8.84,25.03 270 top
U1  31.19,48.4 90 top
U2  31.19,34.43 90 top
U3  39.32,48.4 90 top
U5  39.32,34.68 270 top
U7  55.32,25.79 180 top

### Tracks (layer width: path | path; a pad name or v marks a point on that pad's centre or on a via)
+3V3  (via drill 0.3)
  Top 0.152: R15.1 R9.1 R35.1 58.53,24.52 | R30.1 49.14,33.32 49.22,33.41
  Top 0.254: U1.1 29.29,44.37 C9.1 | U3.1 37.41,44.37 C6.1 | R18.2 26.45,53.64 28.14,51.95 28.14,47.63 28.4,47.38 | C12.1 29.29,30.4 U2.1 | C14.1 41.22,38.7 U5.1 | C15.1 53.86,46.04 53.8,46.11 | C11.1 55.89,46.04 55.83,46.11
  Top 0.406: 52.78,46.04 44.84,46.04 41.26,42.46 39.32,42.46 C6.1 36.52,43.32 36.27,43.57 36.27,47.38 35,48.65 29.67,48.65 28.4,47.38 28.4,44.08 29.16,43.32 C9.1 30.24,43.22 C5.1 | 52.78,46.04 C15.1 | C13.1 30.24,28.33 | 30.24,28.33 30.24,29.25 C12.1 | 30.24,28.33 30.33,28.42 33.31,28.42 35.51,30.62 35.51,34.17 36.27,34.93 36.27,39.4 37.48,40.62 39.31,40.62 C14.1 40.99,39.76 44.91,35.85 44.91,34.43 45.92,33.41 49.22,33.41 51.51,33.41 52.78,34.68 52.78,46.04 | U7.36 44.4,11.82 42.26,9.69 38.4,9.69 37.79,10.3 37.79,12.07 JP1.5 27.38,13.34 26.36,12.33 JP3.2 24.33,9.28 23.06,9.28 22.21,10.13 R3.1 18.91,10.04 13.41,10.04 13.16,10.3 13.16,10.87 C42.1 12.39,11.31 | 12.39,11.31 C41.1 | v12.14,9.53 12.14,10.04 12.39,10.3 12.39,11.31
  Top 0.711: U7.36 46.86,12.25 47.43,12.25 58.53,23.34 58.53,24.52 58.53,27.47 59.38,28.33 65.23,28.33 65.73,28.84 65.73,50.94 65.23,51.44 62.94,51.44 57.61,46.11 55.83,46.11 53.8,46.11
  Bottom 0.406: J5.P4 12.04,9.44 v12.14,9.53
BOOTSEL
  Top 0.152: U7.BOOTSEL 58.39,13.85 R16.1
DMAN_RX_1
  Top 0.152: U3.2 38.68,48.27 39.32,48.9 50.49,48.9 50.84,49.25 R24.1
DMAN_RX_2
  Top 0.152: R25.1 50.84,41.88 50.04,41.08 45.62,41.08 44.67,42.03 36.46,42.03 35.3,43.19 35.3,46.24 33.86,47.69 30.99,47.69 30.55,47.25 U1.2
DMAN_RX_3
  Top 0.152: U2.2 30.55,33.28 31.19,33.92 33.22,33.92 35.2,35.9 35.2,39.38 37.18,41.35 40.44,41.35 40.46,41.34 40.55,41.25 45.79,36 50.49,36 50.84,36.34 R26.1
DMAN_RX_4
  Top 0.152: R20.1 50.75,24.43 50.75,23.76 50.49,23.5 44.83,23.5 43.38,24.95 43.38,32.65 41.35,34.68 40.59,34.68 39.95,35.31 U5.2
DMAN_TX_1
  Top 0.152: U3.3 39.95,47.96 40.59,48.6 50.55,48.6 50.84,48.31 R23.1
DMAN_TX_2
  Top 0.152: U1.3 31.82,47 32.21,47.38 33.73,47.38 35,46.11 35,43.06 36.34,41.72 44.54,41.72 45.49,40.78 50.24,40.78 50.84,40.18 R22.1
DMAN_TX_3
  Top 0.152: R21.1 50.84,35.35 50.49,35.7 45.67,35.7 40.46,40.9 40.33,41.03 40.32,41.05 37.3,41.05 35.51,39.25 35.51,35.77 33.35,33.61 32.41,33.61 31.82,33.03 U2.3
DMAN_TX_4
  Top 0.152: U5.3 38.68,35.82 40.33,34.17 41.1,34.17 42.87,32.39 42.87,25.03 44.7,23.2 50.55,23.2 50.84,22.91 R17.1
DNVT_1_SWITCH_RX_GREEN
  Top 0.254: L4.2 47.07,83.83 46.94,83.96 GDT2.L2 46.94,91.58 47.45,92.08 48.97,92.08 49.99,93.1 49.99,95.39 51,96.4 51,97.93 50.49,98.43 48.97,98.43 48.46,97.93 48.46,96.66 46.94,95.13 46.94,94.12 46.18,93.35 44.52,93.35 J1.6
DNVT_1_SWITCH_RX_GREEN-WHITE
  Top 0.254: L3.2 52.91,83.7 53.54,83.7 GDT2.L1 53.54,91.57 53.54,91.58 53.03,92.08 51.51,92.08 50.4,93.19 50.4,95.23 51.41,96.23 51.41,98.09 50.66,98.84 48.36,98.84 47.06,97.55 J1.3
DNVT_1_SWITCH_TX_BLUE
  Top 0.254: L2.2 57.73,83.7 57.1,83.7 GDT1.L2 57.1,91.25 53.9,94.46 53.9,96.74 50.08,100.56 47.54,100.56 45.8,98.81 J1.4
DNVT_1_SWITCH_TX_BLUE-WHITE
  Top 0.254: L1.2 62.94,83.19 63.07,83.07 63.7,83.7 GDT1.L1 63.7,91.32 63.19,91.83 57.1,91.83 54.3,94.62 54.3,96.91 50.24,100.97 47.38,100.97 45.39,98.98 45.39,98.03 J1.5
DNVT_2_SWITCH_RX_BROWN
  Top 0.254: L7.2 32.59,83.7 33.22,83.7 GDT4.L1 33.22,92.08 35.76,94.62 J1.8
DNVT_2_SWITCH_RX_BROWN-WHITE
  Top 0.254: L8.2 26.75,83.83 26.62,83.96 GDT4.L2 26.62,91.07 27.38,91.83 31.95,91.83 37.29,97.16 J1.7
DNVT_2_SWITCH_TX_ORANGE
  Top 0.254: L6.2 37.41,83.7 36.78,83.7 GDT3.L2 36.78,91.58 37.79,92.59 46.3,92.59 J1.2
DNVT_2_SWITCH_TX_ORANGE-WHITE
  Top 0.254: L5.2 42.62,83.19 42.75,83.07 43.38,83.7 GDT3.L1 43.38,91.57 43.99,92.19 46.47,92.19 47.95,93.67 48.73,93.67 49.29,94.23 49.29,96.85 J1.1
DNVT_3_SWITCH_RX_GREEN
  Top 0.254: L12.2 6.43,83.83 6.3,83.96 GDT6.L2 6.3,91.58 7.47,92.74 22.2,92.74 22.94,93.48 J2.6
DNVT_3_SWITCH_RX_GREEN-WHITE
  Top 0.254: L11.2 12.27,83.7 12.9,83.7 GDT6.L1 12.9,91.07 14.17,92.34 22.74,92.34 24.01,93.61 26.11,93.61 26.74,94.24 J2.3
DNVT_3_SWITCH_TX_BLUE
  Top 0.254: L10.2 17.09,83.7 16.46,83.7 GDT5.L2 16.46,91.07 16.97,91.58 23.06,91.58 24.23,92.74 30.68,92.74 32.31,94.37 32.31,99.03 30.77,100.57 25.86,100.57 24.61,99.32 24.61,98.11 25.16,97.56 25.16,94.94 J2.4
DNVT_3_SWITCH_TX_BLUE-WHITE
  Top 0.254: GDT5.L1 23.06,87.26 | 23.06,87.26 23.06,83.7 22.43,83.07 22.3,83.19 L9.2 | 23.06,87.26 23.06,90.81 24.59,92.34 30.94,92.34 32.71,94.12 32.71,99.2 30.94,100.97 25.6,100.97 24.2,99.58 J2.5
DNVT_4_SWITCH_RX_BROWN
  Top 0.254: L15.2 11.5,43.32 12.14,43.32 GDT8.L1 12.14,50.68 11.86,50.97 6.27,50.97 3.2,54.03 3.2,91.27 6.75,94.83 16.54,94.83 18.47,96.76 19.76,96.76 20.39,96.12 J2.8
DNVT_4_SWITCH_RX_BROWN-WHITE
  Top 0.254: GDT8.L2 5.54,47.63 | 5.54,47.63 5.54,43.57 5.66,43.44 L16.2 | 5.54,47.63 5.03,47.63 5.54,48.14 5.54,50.94 2.79,53.68 2.79,91.44 6.59,95.23 16.37,95.23 18.3,97.16 J2.7
DNVT_4_SWITCH_TX_ORANGE  (via drill 0.3)
  Top 0.254: L14.2 16.33,43.32 15.44,43.32 GDT7.L2 15.44,50.93 14.68,51.7 6.55,51.7 3.86,54.39 3.86,90.92 7.06,94.12 19,94.12 19.51,93.61 21.03,93.61 21.35,93.93 21.35,95.45 22.62,96.72 22.62,99.77 25.09,102.24 v27.89,102.24
  Bottom 0.254: 27.89,94.75 J2.2 28.02,94.75 28.14,94.88 28.14,101.99 v27.89,102.24
DNVT_4_SWITCH_TX_ORANGE-WHITE  (via drill 0.3)
  Top 0.254: L13.2 21.54,42.81 22.05,43.32 22.04,43.32 GDT7.L1 22.05,50.68 21.76,50.97 15.98,50.97 14.85,52.1 6.72,52.1 4.27,54.56 4.27,90.56 7.31,93.61 18.93,93.61 19.34,93.2 21.2,93.2 21.76,93.76 21.76,95.28 23.03,96.55 23.03,99.6 25.26,101.84 27.4,101.84 27.62,101.61 28.15,101.61 28.53,101.99 v28.9,101.99
  Bottom 0.254: v28.9,101.99 28.9,101.74 28.55,101.38 28.55,97.9 J2.1
GND  (via drill 0.3)
  Top 0.152: R28.2 v52.02,29.6 | R31.2 60.15,26.97 v60.15,25.79
  Top 0.254: R19.1 26.11,57.88 v26.11,58.56 | C17.2 34.43,55.51 v33.22,55.51 | C31.2 14.36,55.51 v13.16,55.51 | C1.2 54.75,55.51 v53.54,55.51 | U1.4 33.09,44.46 v32.97,44.33 32.97,44.24 C9.2 | U3.4 41.22,44.46 v41.1,44.33 41.1,44.24 C6.2 | U2.4 33.09,30.49 | 33.09,30.49 v32.97,30.36 | U5.4 37.29,37.28 v37.29,38.74 37.45,38.74 C14.2 | C12.2 33.09,30.4 33.09,30.49 | C24.2 13.34,15.12 v12.14,15.12 | 25.99,31.5 v26.11,31.38
  Top 0.406: C15.2 v54.05,42.81 | C11.2 v56.08,42.81 | C13.2 v33.48,27.31 | C5.2 v33.48,41.28 | C42.2 v15.95,11.31 | C41.2 9.09,11.22 v9.09,10.3 | v26.11,31.38 26.11,32.78 R8.1 C16.1 26.11,35.31 v26.11,36.71
  Bottom 0.508: C39.1 8.08,61.35 | C38.1 61.92,61.1
  pour Route2: 0.71,109.36 69.29,109.1 69.29,0.64 0.71,0.9
  pour Bottom: 65.99,0.64 65.99,61.86 6.3,61.86 6.3,55.25 7.82,53.73 15.19,53.73 16.2,52.71 23.06,52.71 25.35,50.43 25.35,21.73 4.27,21.73 4.27,3.69 33.73,3.69 33.73,0.64
GP0_SD_MISO
  Top 0.152: R10.2 U7.1
GP1_SD_SS
  Top 0.152: R1.2 U7.2
GP2_SD_CLK
  Top 0.152: R4.2 63.7,9.79 U7.4
GP3_SD_MOSI
  Top 0.152: R2.2 U7.5
GP4_REBOOT
  Top 0.152: R27.1 63.28,14.36 U7.6
GP5_SD_DET  (via drill 0.3)
  Top 0.152: v5.79,20.96 5.28,20.96 4.77,20.46 4.77,13.09 8.33,9.53 11.31,9.53 11.9,8.95 12.38,8.95 12.97,9.53 17.47,9.53 19,8.01 R3.2 19.93,7.5 33.73,7.5 35,6.23 43.89,6.23 45.67,8.01 46.68,8.01 55.83,17.15 63.96,17.15 U7.7
  Bottom 0.152: J5.DSW1 6.8,20.96 v5.79,20.96
GP6_OLED_SDA
  Top 0.152: U7.9 64.21,21.89 R15.2 60.74,18.42 55.07,18.42 47.45,10.8 44.4,10.8 42.62,9.03 33.73,9.03 JP3.4
GP7_OLED_SCL
  Top 0.152: R9.2 61.76,22.07 U7.10 65.48,23.25 65.48,21.22 64.97,20.71 63.7,20.71 62.94,19.95 62.94,18.68 62.18,17.92 55.57,17.92 47.95,10.3 44.91,10.3 43.13,8.52 31.7,8.52 JP3.3
GP8_REVISION_1
  Top 0.152: R35.2 R31.1 U7.11
GP9
  Top 0.152: JP1.2 43.64,12.84 46.94,12.84 57.86,23.76 57.86,27.63 59.83,29.6 U7.12
GP10
  Top 0.152: JP1.1 47.02,13.34 57.55,23.88 57.55,28.02 U7.14
GP11
  Top 0.152: JP1.4 40.59,12.33 40.59,13.85 42.11,15.38 48.46,15.38 57.25,24.16 57.25,30.26 U7.15
GP12
  Top 0.152: JP1.3 39.65,13.34 41.99,15.68 48.34,15.68 56.95,24.29 56.95,32.5 U7.16
GP13
  Top 0.152: SW2.7 39.32,18.42 43.89,18.42 44.4,17.92 49.99,17.92 56.64,24.57 56.64,34.73 U7.17
GP14
  Top 0.152: SW2.6 37.08,18.73 44.02,18.73 44.52,18.22 49.86,18.22 56.34,24.7 56.34,39.51 U7.19
GP15
  Top 0.152: SW2.5 36.52,20.71 51.92,20.71 56.03,24.82 56.03,41.74 U7.20
GP22_REVISION_2
  Top 0.152: R30.2 50.84,31.72 49.14,30.02 R28.1 U7.29
GP28
  Top 0.152: SW2.8 U7.34
N$1
  Top 0.254: 64.05,78.46 C10.1 64.14,80.21 63.83,80.53 L1.1 | 64.05,78.46 63.96,78.56 | 64.05,78.46 64.05,77.68 D3.C 61.35,74.98 R5.2 61.35,72.75 T1.1
N$2
  Top 0.254: C2.2 57.35,78.81 | L2.1 57.48,80.53 56.91,79.96 C2.2 | C2.2 56.91,77.52 D3.A 59.45,74.98 R5.1 59.45,72.75 T1.3
N$3
  Top 0.254: L3.1 52.91,80.65 53.54,80.65 54.05,80.15 53.98,80.08 C4.1 53.98,77.77 D4.C 51.19,74.98 R6.2 51.19,72.75 T2.1
N$4
  Top 0.254: L4.1 47.07,80.53 46.75,80.21 C3.2 46.75,77.52 D4.A 49.29,74.98 R6.1 49.29,72.75 T2.3
N$5
  Top 0.254: R7.2 46.68,72.85 46.68,69.99 46.94,69.73 49.99,69.73 50.24,69.99 T2.2
N$6
  Top 0.254: T1.2 60.4,69.99 60.15,69.73 57.1,69.73 55.32,71.51 F1.1
N$7
  Top 0.152: R20.2 U7.31
N$8
  Top 0.254: T4.6 32.46,59.13 C22.1 30.87,55.96 R41.2 30.55,54.74 U1.7
N$9
  Top 0.254: T2.6 52.78,59.13 C7.1 51.19,55.7 R14.2 49.71,53.32 39.32,53.32 38.68,52.69 U3.7
N$10
  Top 0.254: T2.4 47.7,59.13 C7.2 49.29,55.7 R14.1 47.7,55.25 46.18,53.73 39.06,53.73 37.41,52.08 U3.8
N$11
  Top 0.254: R11.1 C8.2 59.38,57.47 R13.2 57.86,57.98 T1.4
N$12
  Top 0.254: 63.38,57.54 C8.1 R11.2 | 63.38,57.54 R12.2 | T1.6 62.94,57.98 63.38,57.54
N$13
  Top 0.152: R17.2 U7.32
N$14
  Top 0.254: U3.5 41.22,52.18 41.35,52.31 60.18,52.31 R12.1
N$16
  Top 0.254: U3.6 39.95,52.08 40.59,52.71 55.32,52.71 57.35,54.75 R13.1
N$17
  Top 0.152: R24.2 U7.21
N$18
  Top 0.152: R23.2 U7.22
N$19
  Top 0.152: SW1.S2 57.57,11.02 59.38,12.84 60.91,12.84 61.76,13.69 R16.2 61.76,14.18 R27.2
N$20
  Top 0.762: CR1.A CR2.K 63.52,97.26 J4.1
N$21
  Top 0.152: R25.2 U7.24
N$22
  Top 0.152: R22.2 U7.25
N$23
  Top 0.152: R21.2 U7.27
N$24
  Top 0.152: R26.2 U7.26
N$25  (via drill 0.3)
  Top 0.152: R4.1 60.06,9.11 60.2,8.98 60.2,7.05 58.93,5.77 58.93,4 58.11,3.18 49.22,3.18 47.19,5.22 34.49,5.22 33.22,6.49 13.16,6.49 v13.16,6.56
  Bottom 0.152: J5.P5 13.16,8.33 v13.16,6.56
N$27
  Top 0.406: R29.1 55.07,99.58 55.07,103.13 C40.1
N$28  (via drill 0.3)
  Top 0.152: R10.1 48.21,1.66 47.19,2.68 35.25,2.68 32.71,5.22 v15.44,5.22
  Bottom 0.152: J5.P7 15.34,5.31 v15.44,5.22
N$30  (via drill 0.3)
  Top 0.152: R2.1 59.38,11.82 59.13,11.57 59.13,9.03 59.89,8.26 59.89,7.25 58.62,5.98 58.62,4.71 57.86,3.95 49.22,3.95 47.45,5.72 34.75,5.72 33.48,6.99 13.92,6.99 13.66,7.25 v11.12,7.25
  Bottom 0.152: J5.P3 10.94,7.43 v11.12,7.25
N$31  (via drill 0.3)
  Top 0.152: v9.85,7.25 11.12,5.98 32.89,5.98 35.89,2.98 47.32,2.98 48.33,1.97 57.82,1.97 R1.1
  Bottom 0.152: v9.85,7.25 9.85,8.34 J5.P2
N$44
  Top 0.254: T4.4 27.38,59.13 C22.2 28.97,55.96 R41.1 29.29,54.74 U1.8
N$45
  Top 0.254: T6.6 12.14,58.88 C36.1 10.8,56.21 R61.2 12.63,54.39 15.93,54.39 16.95,53.37 24.25,53.37 26.11,51.51 26.11,41.03 28.7,38.44 30.23,38.44 30.55,38.11 U2.7
N$52
  Top 0.254: T6.4 7.06,59.38 C36.2 8.9,55.31 R61.1 10.23,53.98 15.51,53.98 16.52,52.97 24.08,52.97 25.6,51.44 25.6,40.78 28.4,37.98 28.9,37.98 29.16,37.73 29.16,37.03 U2.8
N$63
  Top 0.254: 43.73,78.46 C18.1 43.82,80.21 43.51,80.53 L5.1 | 43.73,78.46 43.64,78.56 | 43.73,78.46 43.73,77.68 D8.C 41.03,74.98 R32.2 41.03,72.75 T3.1
N$64
  Top 0.254: C19.2 37.03,78.81 | L6.1 37.16,80.53 36.59,79.96 C19.2 | C19.2 36.59,77.52 D8.A 39.13,74.98 R32.1 39.13,72.75 T3.3
N$65
  Top 0.254: L7.1 32.59,80.65 33.22,80.65 33.73,80.15 33.66,80.08 C21.1 33.66,77.77 D9.C 30.87,74.98 R33.2 30.87,72.75 T4.1
N$66
  Top 0.254: L8.1 26.75,80.53 26.43,80.21 C20.2 26.43,77.52 D9.A 28.97,74.98 R33.1 28.97,72.75 T4.3
N$67
  Top 0.254: T4.2 29.92,69.99 29.67,69.73 26.62,69.73 26.36,69.99 26.36,72.85 R34.2
N$68
  Top 0.254: T3.2 40.08,69.99 39.83,69.73 36.78,69.73 35,71.51 F2.1
N$71
  Top 0.254: 43.06,57.54 C23.1 R36.2 | 43.06,57.54 R37.2 | T3.6 42.62,57.98 43.06,57.54
N$72
  Top 0.254: U1.5 33.09,52.84 33.98,53.73 37.03,53.73 37.54,54.24 42.87,54.24 43.13,54.49 R37.1
N$73
  Top 0.254: R38.1 37.03,54.49 36.68,54.14 33.37,54.14 31.82,52.59 U1.6
N$79
  Top 0.254: R36.1 C23.2 39.06,57.47 R38.2 37.54,57.98 T3.4
N$81
  Top 0.254: 22.39,38.08 C25.1 22.49,39.83 22.17,40.14 L13.1 | 22.39,38.08 22.3,38.17 | 22.39,38.08 22.39,37.29 D10.C 19.69,34.59 R42.2 19.69,32.37 T7.1
N$82
  Top 0.254: C26.2 15.7,38.42 | L14.1 15.82,40.14 15.25,39.57 C26.2 | C26.2 15.25,37.13 D10.A 17.79,34.59 R42.1 17.79,32.37 T7.3
N$83
  Top 0.254: L15.1 11.5,40.27 12.14,40.27 12.65,39.76 12.58,39.69 C28.1 12.58,37.13 D11.C 9.79,34.34 R43.2 9.79,32.37 T8.1
N$84
  Top 0.254: L16.1 5.66,40.14 5.35,39.83 C27.2 5.35,37.39 D11.A 7.89,34.85 R43.1 7.89,32.37 T8.3
N$85
  Top 0.254: T8.2 8.84,29.6 8.58,29.35 5.54,29.35 5.03,29.85 R44.2
N$86
  Top 0.254: T7.2 18.74,29.6 18.49,29.35 15.44,29.35 14.17,30.62 F4.1
N$88
  Top 0.254: T8.6 11.38,18.74 C29.1 9.79,15.32 R51.2 11.55,13.56 26.32,13.56 36.27,23.5 36.27,27.06 39.95,30.74 U5.7
N$89
  Top 0.254: 21.73,17.15 C30.1 R46.2 | 21.73,17.15 R47.2 | T7.6 21.28,17.6 21.73,17.15
N$90
  Top 0.254: R47.1 22.48,14.5 24.73,14.5 33.73,23.5 33.73,26.3 37.41,29.98 U5.5
N$91
  Top 0.254: R48.1 16.79,14.09 24.89,14.09 34.24,23.44 34.24,26.23 38.68,30.68 U5.6
N$97
  Top 0.254: R46.1 C30.2 17.73,17.09 R48.2 16.2,17.6 T7.4
N$98
  Top 0.254: T8.4 6.3,18.74 C29.2 7.89,15.32 R51.1 8.14,14.87 9.86,13.15 26.49,13.15 36.68,23.34 36.68,26.89 41.16,31.38 41.22,31.38 U5.8
N$99
  Top 0.254: C32.1 23.66,78.21 23.66,76.43 23.06,75.83 D12.C 20.71,74.72 R52.2 20.71,72.75 T5.1 | C32.1 23.32,78.56 | L9.1 23.19,80.53 23.5,80.21 C32.1
N$100
  Top 0.254: C33.2 16.71,78.81 | L10.1 16.84,80.53 16.27,79.96 C33.2 | C33.2 16.27,77.77 D12.A 18.81,75.23 R52.1 18.81,72.75 T5.3
N$101
  Top 0.254: L11.1 12.27,80.65 12.9,80.65 13.41,80.15 13.34,80.08 C35.1 13.34,77.77 D13.C 10.55,74.98 R53.2 10.55,72.75 T6.1
N$102
  Top 0.254: L12.1 6.43,80.53 6.11,80.21 C34.2 6.11,77.52 D13.A 8.65,74.98 R53.1 8.65,72.75 T6.3
N$103
  Top 0.254: 9.6,71.25 T6.2 9.6,69.99 9.35,69.73 6.3,69.73 5.54,70.49 R54.2
N$104
  Top 0.254: T5.2 19.76,69.99 19.51,69.73 16.46,69.73 14.68,71.51 F3.1
N$107
  Top 0.254: 22.74,57.54 C37.1 R56.2 | 22.74,57.54 R57.2 | T5.6 22.3,57.98 22.74,57.54
N$108
  Top 0.254: R57.1 23.99,54.39 24.5,54.39 27.13,51.77 27.13,41.54 29.41,39.25 32.46,39.25 33.09,38.62 U2.5
N$109
  Top 0.254: R58.1 16.71,54.49 17.22,53.98 24.33,53.98 26.62,51.7 26.62,41.28 29.06,38.85 31.6,38.85 31.82,38.62 U2.6
N$115
  Top 0.254: R56.1 C37.2 18.74,57.47 R58.2 17.22,57.98 T5.4
PE  (via drill 0.3)
  Top 0.254: C34.1 v9.85,78.37 C35.2 | C33.1 v19.76,78.37 C32.2 | C20.1 v30.17,78.37 C21.2 | C19.1 v40.08,78.37 C18.2 | C3.1 v50.49,78.37 C4.2 | C2.1 v60.4,78.37 C10.2 | C27.1 v9.09,37.98 C28.2 | C26.1 v18.74,37.98 C25.2 | R54.1 v5.54,77.1 | R34.1 24.91,74.49 v24.84,74.56 | R7.1 45.23,74.49 v45.16,74.56 | R44.1 v5.03,36.71
  Top 0.406: C40.2 59.37,107.71 J4.2 | v23.06,36.71 23.06,35.31 C16.2 R8.2 23.06,32.78 v23.06,31.38 | v8.08,90.81 v11.12,90.81 | v8.08,88.27 GDT6.C v11.12,88.27 | v8.08,85.73 v11.12,85.73 | v18.24,90.81 v21.28,90.81 | v21.28,88.27 GDT5.C v18.24,88.27 | v18.24,85.73 v21.28,85.73 | v28.4,90.81 v31.44,90.81 | v31.44,88.27 GDT4.C v28.4,88.27 | v28.4,85.73 v31.44,85.73 | v38.56,90.81 v41.6,90.81 | v41.6,88.27 GDT3.C v38.56,88.27 | v38.56,85.73 v41.6,85.73 | v48.72,90.81 v51.76,90.81 | v51.76,88.27 GDT2.C v48.72,88.27 | v48.72,85.73 v51.76,85.73 | v58.88,90.81 v61.92,90.81 | v61.92,88.27 GDT1.C v58.88,88.27 | v58.88,85.73 v61.92,85.73 | v7.31,50.17 v10.36,50.17 | v10.36,47.89 GDT8.C v7.31,47.89 | v7.31,45.35 v10.36,45.35 | v17.22,50.17 v20.27,50.17 | v20.27,47.89 GDT7.C v17.22,47.89 | v17.22,45.35 v20.27,45.35
  Top 0.762: CR2.A 66.42,100.66 J4.2
  Bottom 0.508: C39.2 8.08,68.72 | C38.2 61.92,68.97
  other vias: 27.13,99.7 29.92,99.7 30.17,95.39 27.38,95.89
  pour Bottom: 0.46,109.36 69.54,109.36 69.54,0.64 68.27,0.64 68.27,68.46 4.77,68.46 4.77,54.49 7.06,52.21 15.19,52.21 15.95,51.44 22.3,51.44 23.82,49.92 23.82,28.08 1.73,28.08 1.73,0.64 0.46,0.64
  pour Top: 0.46,0.64 1.73,0.64 1.73,92.85 5.28,96.4 15.44,96.4 15.95,96.91 15.95,109.36 0.46,109.36
  pour Top: 68.27,0.64 69.54,0.64 69.54,109.36 60.15,109.36 60.15,102.75 61.42,101.48 61.92,100.97 68.27,100.97
  pour Top: 26.62,100.21 30.43,100.21 30.43,95.13 26.62,95.13
V+
  Top 0.254: F3.2 13.16,73.42 13.16,69.22 13.41,68.97 13.54,68.97 | F2.2 33.48,73.42 33.48,68.97 | F1.2 53.8,73.42 53.8,68.97 | F4.2 12.65,33.03 12.65,29.85 11.63,28.84 5.03,28.84 3.25,30.62 3.25,51.95 2.23,52.97 2.23,91.83 6.3,95.89 15.95,95.89 28.9,108.85 53.8,108.85 54.56,108.09 54.56,98.69 55.57,97.67 55.57,95.89 56.47,95 R29.2
  Top 0.406: 57.03,94.81 R29.2
  Top 0.762: 13.54,68.97 33.48,68.97 53.8,68.97 64.72,68.97 66.24,70.49 66.24,91.24 64.63,92.85 59.38,92.85 58.95,93.28 CR1.K 58.37,94.37 57.92,94.81 57.03,94.81
VMID
  Top 0.254: T8.5 8.84,20.46 9.09,20.71 12.9,20.71 13.28,20.33 | C24.1 13.41,20.2 13.28,20.33 | T6.5 9.6,60.84 9.85,61.1 13.66,61.1 14.43,60.33 | C31.1 14.43,60.33 | T4.5 29.92,60.84 | 29.92,60.84 30.17,61.1 33.98,61.1 34.49,60.59 | C17.1 34.49,60.59 | T2.5 50.24,60.84 | 50.24,60.84 50.49,61.1 54.3,61.1 54.81,60.59 C1.1 | 14.43,60.33 15.19,61.1 24.84,61.1 | 29.92,60.84 29.67,61.1 24.84,61.1 | 34.49,60.59 35,61.1 49.99,61.1 50.24,60.84 | 24.84,61.1 24.75,61.01 R19.2 R18.1 24.75,54.71 27.53,51.93 27.53,41.71 29.23,40.01 33.22,40.01 33.98,39.25 33.98,35.44 32.97,34.43 29.67,34.43 27.63,32.39 27.63,21.98 26.36,20.71 13.66,20.71 13.28,20.33
(copper drawn outside any net)
  shapes: Top circle x3

### Text on the board
tPlace: EARTH | 48V IN | PHONE3/4 | PHONE1/2 | MMXXIII | DNVT Switch Rev2R | PHONE2 | PHONE1 | PHONE4 | PHONE3 | 15 | 14 | 13 | 28 | GND | VCC | SCL | SDA | GPIO | OLED SCREEN | BOOTSEL
tNames: JLCJLCJLCJLC
tStop: 002